# EAGLE design Drawdio PNP (EAGLE 6.4)
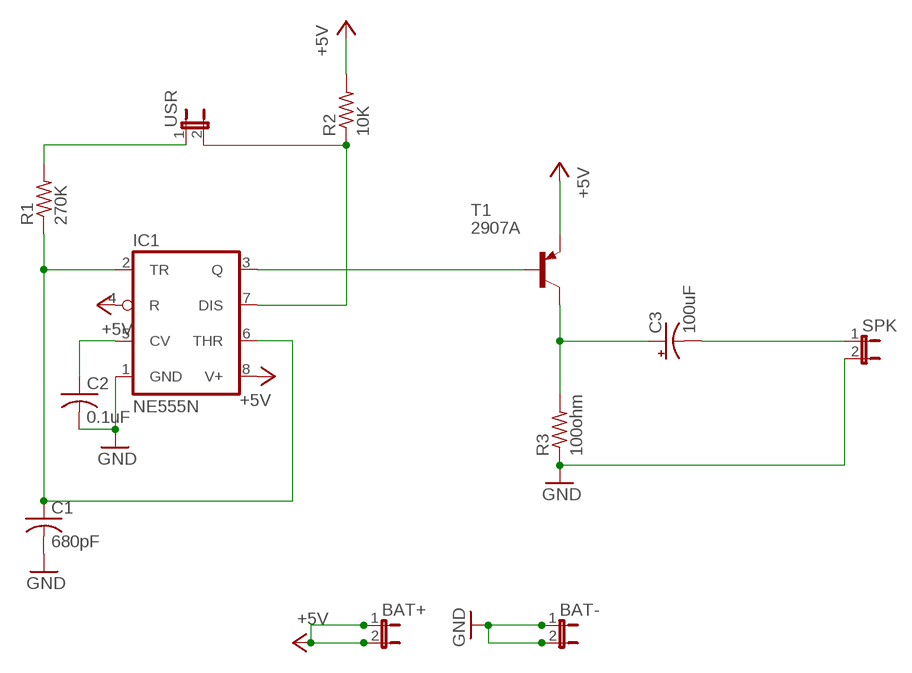
[diagram p0: schematic, sheet 1]

## Parts
BAT+  JP1E  [JP1]
BAT-  JP1E  [JP1]
C1  680pF  C-US025-025X050  [C025-025X050]
C2  0.1uF  C-US050-025X075  [C050-025X075]
C3  100uF  CPOL-USE2.5-5  [E2,5-5]
IC1  NE555N  [DIL08]
R1  270K  R-US_0204/7  [0204/7]
R2  10K  R-US_0204/7  [0204/7]
R3  100ohm  R-US_0204/7  [0204/7]
SPK  JP1E  [JP1]
T1  2907A  MPS2907A-PNP-TO92-CBE  [TO92-CBE]
USR  JP1E  [JP1]

## Nets
+5V: BAT+.1 BAT+.2 IC1.4(R) IC1.8(V+) R2.2 T1.E
GND: BAT-.1 BAT-.2 C1.2 C2.2 IC1.1(GND) R3.1 SPK.2
N$1: R1.2 USR.1
N$2: IC1.7(DIS) R2.1 USR.2
N$3: IC1.3(Q) T1.B
N$4: C1.1 IC1.2(TR) IC1.6(THR) R1.1
N$6: C3.+ R3.2 T1.C
N$7: C3.- SPK.1
N$8: C2.1 IC1.5(CV)

## Library data of the parts
BAT+ BAT- SPK USR = jumper:JP1E: JUMPER
C1 C2 = rcl:C-US: CAPACITOR, American symbol
C3 = rcl:CPOL-US: POLARIZED CAPACITOR, American symbol
IC1 = linear:*555: TIMER
R1-R3 = rcl:R-US_: RESISTOR, American symbol
T1 = transistor:*-PNP-: PNP Transistror

## Board
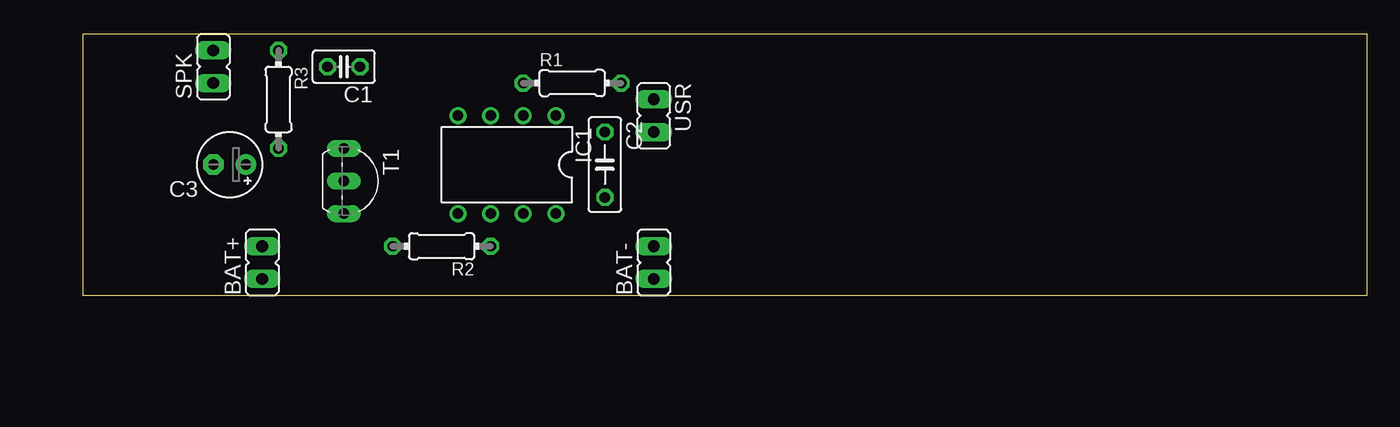
[diagram p1: board, top side]
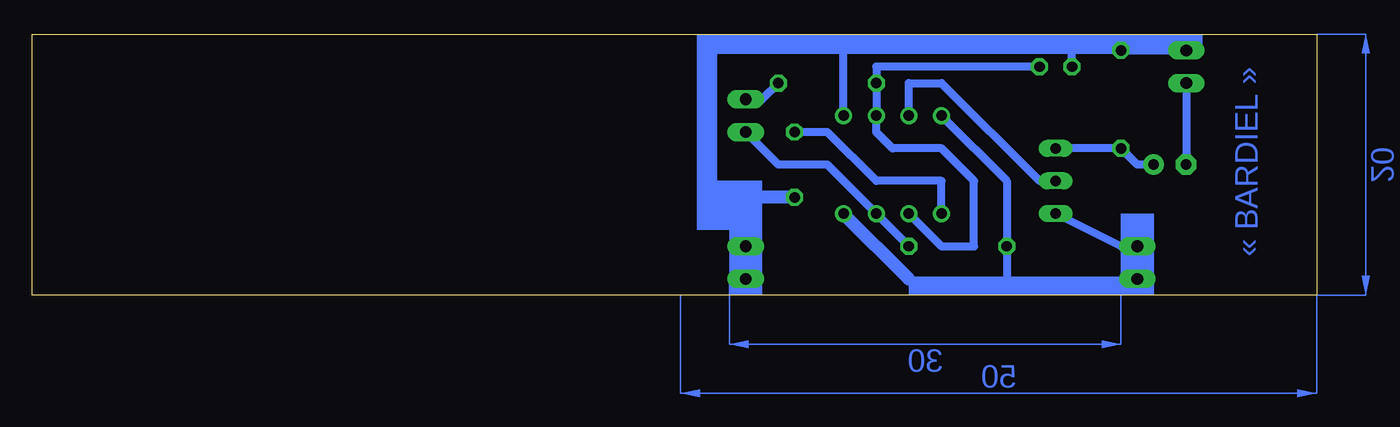
[diagram p2: board, bottom side, seen from below]

Size 100 x 20.31 mm. Coordinates in mm from the lower left corner, seen from the top.
Outline: 0,0 100,0 100,20.31 0,20.31 0,0
Copper layers (1*16): Top 0.035mm / dielectric 1.5mm / Bottom 0.035mm
Design rules "default": minimum track width 10mil, minimum drill 24mil, track to track 8mil, track to pad 8mil, pad to pad 8mil, via to via 8mil, smd to smd 8mil, copper to edge 40mil, drill to drill 8mil, minimum pad ring 10mil, minimum via ring 8mil, stop-mask expansion 4mil, vias tented up to drill 0mil, thermal gap 10mil

### Footprints (pad centres in the part's own frame; a part is rotated, then mirrored left to right if it is on the bottom)
JP1 = drill 0.914 long: 1 0,-1.27; 2 0,1.27
C025-025X050 = drill 0.813 octagon: 1 -1.27,0; 2 1.27,0
C050-025X075 = drill 0.813 octagon: 1 -2.54,0; 2 2.54,0
E2,5-5 = drill 0.813 pad 1.6: + -1.27,0 | drill 0.813 pad 1.6 octagon: - 1.27,0
DIL08 = drill 0.813 pad 1.27: 1 -3.81,-3.81; 2 -1.27,-3.81; 3 1.27,-3.81; 4 3.81,-3.81; 5 3.81,3.81; 6 1.27,3.81; 7 -1.27,3.81; 8 -3.81,3.81
0204/7 = drill 0.813 octagon: 1 -3.81,0; 2 3.81,0
TO92-CBE = drill 0.813 long: B 0,0; C -2.54,0; E 2.54,0

### Placement (x,y rotation side)
BAT+  13.97,2.54 0 top
BAT-  44.45,2.54 0 top
C1  20.32,17.78 180 top
C2  40.64,10.16 270 top
C3  11.43,10.16 180 top
IC1  33.02,10.16 180 top
R1  38.1,16.51 0 top
R2  27.94,3.81 180 top
R3  15.24,15.24 270 top
SPK  10.16,17.78 0 top
T1  20.32,8.89 270 top
USR  44.45,13.97 180 top

### Tracks (layer width: path | path; a pad name or v marks a point on that pad's centre or on a via)
+5V
  Bottom 0.406: 15.24,3.81 BAT+.2 BAT+.1 24.13,1.27 31.75,1.27
  Bottom 0.61: 15.24,3.81 T1.E | 24.13,1.27 R2.2 24.13,8.89 IC1.4
  Bottom 1.016: 31.75,1.27 IC1.8
GND
  Bottom 0.406: BAT-.1 BAT-.2
  Bottom 0.61: 19.05,19.05 R3.1 SPK.2 | 19.05,19.05 36.83,19.05 | 36.83,19.05 46.99,19.05 46.99,7.62 44.45,7.62 | IC1.1 36.83,19.05 | C1.2 19.05,19.05
  Bottom 1.016: C2.2 44.45,7.62 BAT-.2
N$1
  Bottom 0.61: R1.2 43.18,15.24 USR.1
N$2
  Bottom 0.61: USR.2 41.91,10.16 38.1,10.16 IC1.7 R2.1
N$3
  Bottom 0.61: IC1.3 31.75,16.51 29.21,16.51 21.59,8.89 T1.B
N$4
  Bottom 0.61: IC1.6 29.21,3.81 26.67,3.81 26.67,8.89 29.21,11.43 33.02,11.43 34.29,12.7 IC1.2 R1.1 34.29,17.78 C1.1
N$6
  Bottom 0.61: T1.C R3.2 13.97,10.16 C3.+
N$7
  Bottom 0.61: SPK.1 C3.-
N$8
  Bottom 0.61: IC1.5 29.21,8.89 34.29,8.89 38.1,12.7 C2.1
(copper drawn outside any net)
  shapes: Bottom area x13

### Text on the board
Bottom: « BARDIEL »